# EasyEDA Pro project sonos_knobs_v1.1.eprj, board PCB5
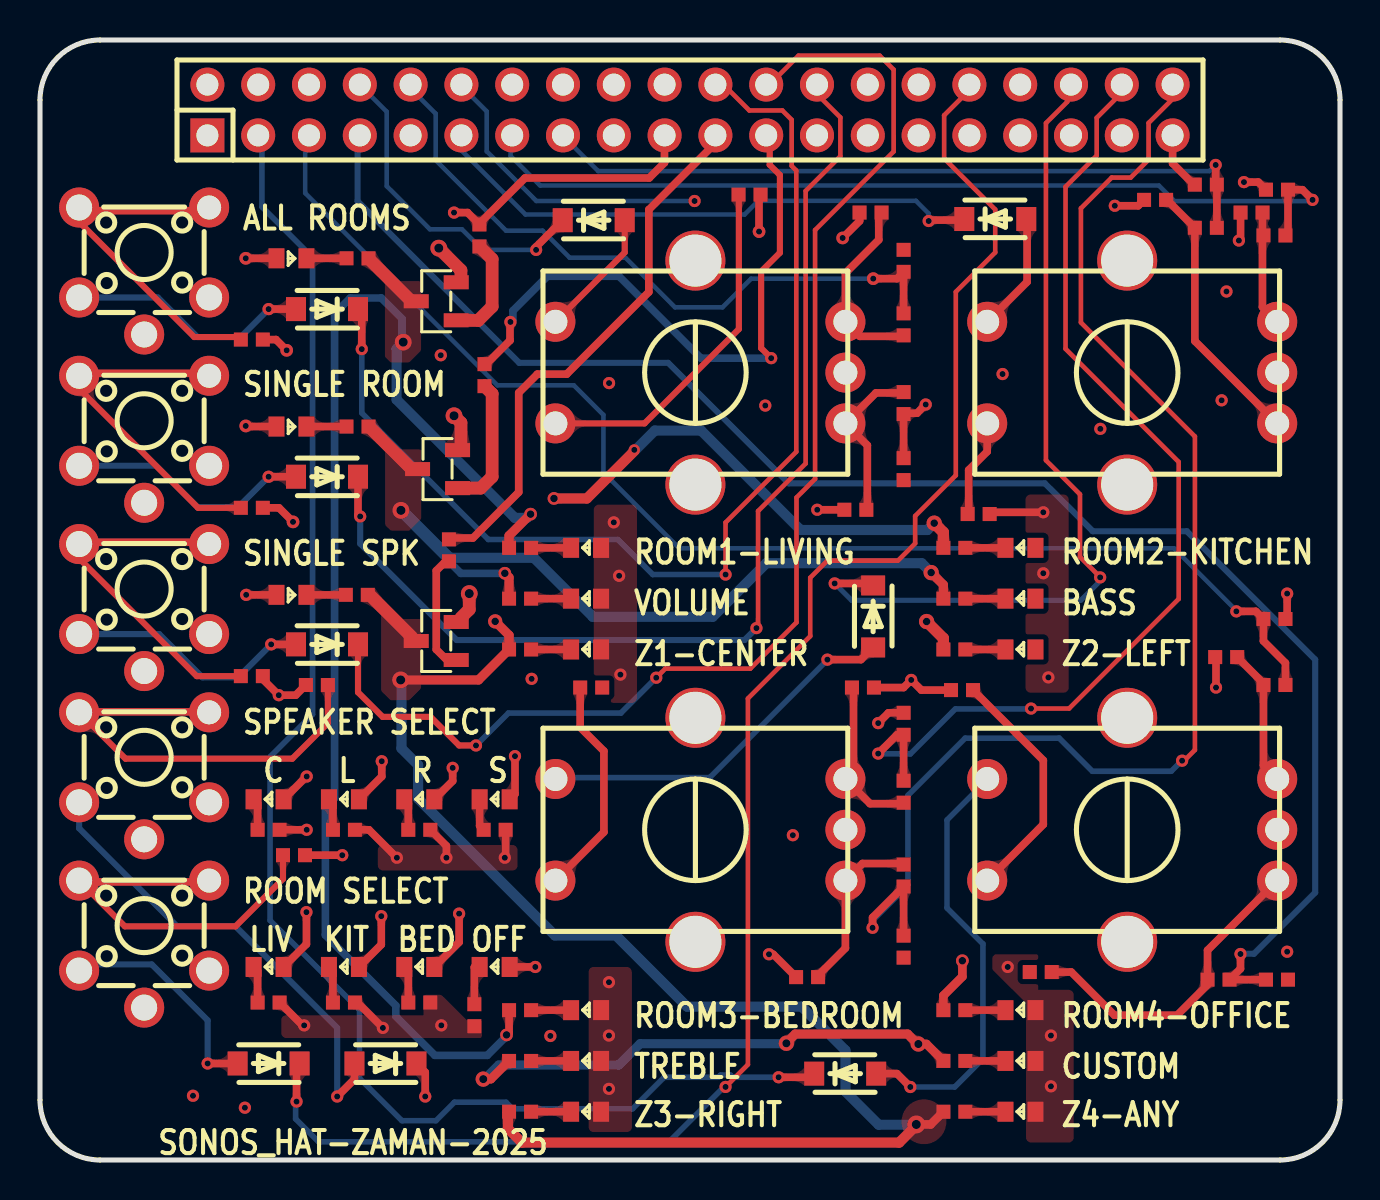
[diagram p4: board, top side]
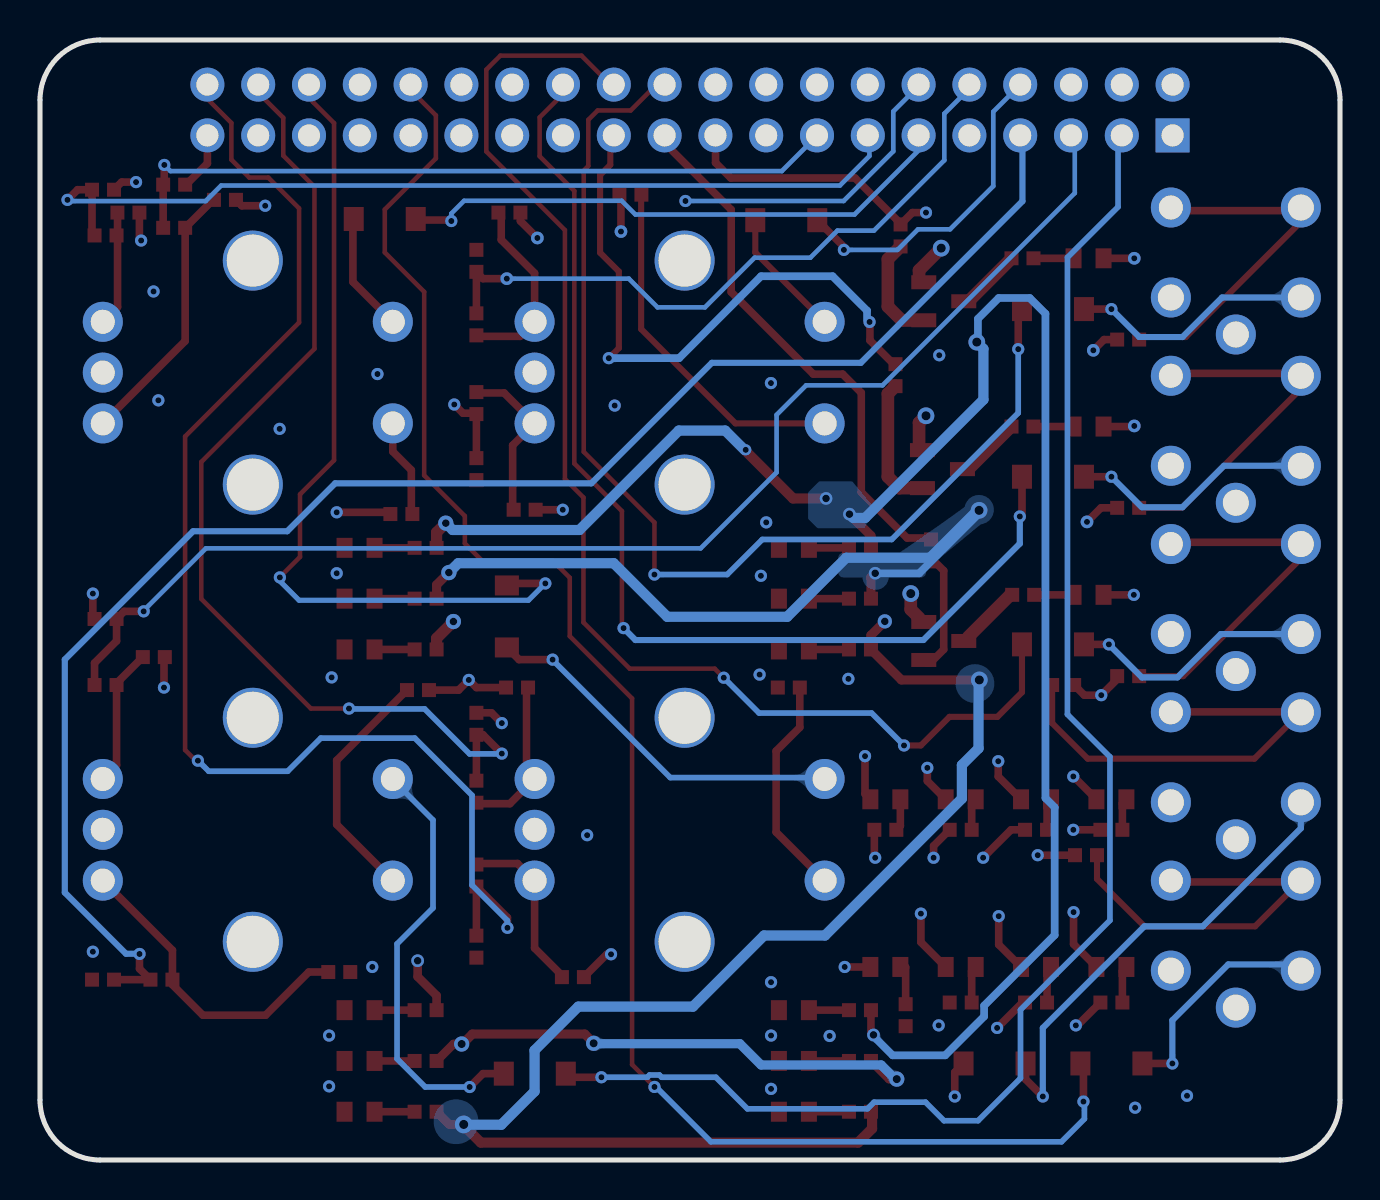
[diagram p5: board, bottom side, seen from below]

Outline 65 x 56 mm; copper layers: Top Layer, Inner1, Inner2, Bottom Layer. Coordinates in mm from the lower left corner of the outline.
Outline path: 0,53 0,3 arc(0.88,0.88) 3,0 62,0 arc(64.12,0.88) 65,3 65,53 arc(64.12,55.12) 62,56 3,56 arc(0.88,55.12) 0,53
Stack: Top Layer 0.035mm Outer layer thickness 1oz / Dielectric1 0.2104mm 7628 RC49% 8.6mil / Inner1 0.0152mm Inner layer thickness / Dielectric2 1.065mm 1.1mm H/HOZ Copper / Inner2 0.0152mm Inner layer thickness / Dielectric3 0.2104mm 7628 RC49% 8.6mil / Bottom Layer 0.035mm Outer layer thickness 1oz

## Design rules (mm)
template: Custom Config
spacing copperThickness1oz (default): track to track 0.102, other pairs 0.152 to 0.3
spacing copperThickness2oz: track to track 0.203, other pairs 0.152 to 0.3
track width copperThickness1oz (default): min 0.127, default 0.381, max 2.54
track width copperThickness2oz: min 0.203, default 0.254, max 2.54
differential pair differentialPair (default): width min 0.127, default 0.254, max 2.54; gap min 0.152, default 0.152
via viaSize (default): diameter min 0.5, default 0.61, max 10; hole min 0.3, default 0.305, max 6.3

## Placement (name value [footprint] x y rotation side)
C1  10nF  [C0402]  43.18 34.54 90 top
C2  10nF  [C0402]  43.18 44.96 270 top
C3  10nF  [C0402]  58.29 48.77 0 top
C4  10nF  [C0402]  61.85 48.51 0 top
C5  10nF  [C0402]  43.18 10.67 90 top
C6  10nF  [C0402]  43.18 21.81 270 top
C7  10nF  [C0402]  61.85 9.02 180 top
C8  10nF  [C0402]  61.72 27.05 180 top
D1  SM4007PL  [SOD-123F_L2.8-W1.8-LS3.7-RD]  14.35 42.55 180 top
D2  SM4007PL  [SOD-123F_L2.8-W1.8-LS3.7-RD]  14.35 34.16 180 top
D3  SM4007PL  [SOD-123F_L2.8-W1.8-LS3.7-RD]  14.35 25.78 180 top
D4  SM4007PL  [SOD-123F_L2.8-W1.8-LS3.7-RD]  17.27 4.83 180 top
D5  SM4007PL  [SOD-123F_L2.8-W1.8-LS3.7-RD]  11.43 4.83 180 top
D6  SM4007PL  [SOD-123F_L2.8-W1.8-LS3.7-RD]  27.69 46.99 0 top
D7  SM4007PL  [SOD-123F_L2.8-W1.8-LS3.7-RD]  47.76 47.05 0 top
D8  SM4007PL  [SOD-123F_L2.8-W1.8-LS3.7-RD]  41.66 27.18 270 top
D9  SM4007PL  [SOD-123F_L2.8-W1.8-LS3.7-RD]  40.26 4.32 0 top
H1  2.54-2*20P母长PC104  [HDR-TH_40P-P2.54-V-F-R2-C20-S2.54-2]  32.5 52.5 0 top
LED1  KT-0603R  [LED0603-RD]  12.57 45.08 180 top
LED2  KT-0603R  [LED0603-RD]  27.31 30.61 0 top
LED3  KT-0603R  [LED0603-RD]  49.02 30.61 0 top
LED4  KT-0603R  [LED0603-RD]  27.31 7.49 0 top
LED5  KT-0603R  [LED0603-RD]  49.02 7.49 0 top
LED6  KT-0603R  [LED0603-RD]  12.57 36.67 180 top
LED7  KT-0603R  [LED0603-RD]  27.31 28.07 0 top
LED8  KT-0603R  [LED0603-RD]  49.02 28.07 0 top
LED9  KT-0603R  [LED0603-RD]  27.31 4.95 0 top
LED10  KT-0603R  [LED0603-RD]  49.02 4.95 0 top
LED11  KT-0603R  [LED0603-RD]  12.57 28.26 180 top
LED12  KT-0603R  [LED0603-RD]  27.31 25.53 0 top
LED13  KT-0603R  [LED0603-RD]  49.02 25.53 0 top
LED14  KT-0603R  [LED0603-RD]  27.31 2.41 0 top
LED15  KT-0603R  [LED0603-RD]  49.02 2.41 0 top
LED16  KT-0603R  [LED0603-RD]  11.43 18.03 0 top
LED17  KT-0603R  [LED0603-RD]  15.2 18.03 0 top
LED18  KT-0603R  [LED0603-RD]  18.97 18.03 0 top
LED19  KT-0603R  [LED0603-RD]  22.73 18.03 0 top
LED20  KT-0603R  [LED0603-RD]  11.43 9.65 0 top
LED21  KT-0603R  [LED0603-RD]  15.2 9.65 0 top
LED22  KT-0603R  [LED0603-RD]  18.97 9.65 0 top
LED23  KT-0603R  [LED0603-RD]  22.73 9.65 0 top
Q1  MMBT2222A 1P  [SOT-23-3_L2.9-W1.3-P1.90-LS2.4-BR]  19.81 42.94 0 top
Q2  MMBT2222A 1P  [SOT-23-3_L2.9-W1.3-P1.90-LS2.4-BR]  19.88 34.54 0 top
Q3  MMBT2222A 1P  [SOT-23-3_L2.9-W1.3-P1.90-LS2.4-BR]  19.81 25.95 0 top
R1  10kΩ  [C0402]  43.18 37.85 90 top
R2  10kΩ  [C0402]  43.18 41.78 90 top
R3  10kΩ  [C0402]  40.77 32.51 0 top
R4  10kΩ  [C0402]  41.53 47.37 0 top
R5  10kΩ  [C0402]  58.29 46.61 180 top
R6  10kΩ  [C0402]  61.72 46.23 0 top
R7  10kΩ  [C0402]  55.75 48.01 180 top
R8  10kΩ  [C0402]  60.58 47.37 180 top
R9  10kΩ  [C0402]  43.18 14.22 270 top
R10  10kΩ  [C0402]  43.18 18.42 270 top
R11  10kΩ  [C0402]  38.35 9.14 0 top
R12  10kΩ  [C0402]  41.15 23.62 180 top
R13  10kΩ  [C0402]  58.93 9.02 180 top
R14  10kΩ  [C0402]  61.72 23.75 0 top
R15  10kΩ  [C0402]  50.04 9.4 180 top
R16  10kΩ  [C0402]  59.31 25.15 180 top
R18  1kΩ  [C0402]  21.97 46.23 270 top
R19  150Ω  [C0402]  15.88 45.08 180 top
R20  150Ω  [C0402]  24 30.61 0 top
R21  150Ω  [C0402]  45.72 30.61 0 top
R22  150Ω  [C0402]  24 7.49 0 top
R23  150Ω  [C0402]  45.72 7.49 0 top
R24  1kΩ  [C0402]  22.22 39.24 270 top
R25  150Ω  [C0402]  15.88 36.67 180 top
R26  150Ω  [C0402]  24 28.07 0 top
R27  150Ω  [C0402]  45.72 28.07 0 top
R28  150Ω  [C0402]  24 4.95 0 top
R29  150Ω  [C0402]  45.72 4.95 0 top
R30  1kΩ  [C0402]  20.45 30.48 270 top
R31  150Ω  [C0402]  15.84 28.26 180 top
R32  150Ω  [C0402]  24 25.53 0 top
R33  150Ω  [C0402]  45.72 25.53 0 top
R34  150Ω  [C0402]  24 2.41 0 top
R35  150Ω  [C0402]  45.72 2.41 0 top
R36  150Ω  [C0402]  11.43 16.51 180 top
R37  150Ω  [C0402]  15.2 16.51 180 top
R38  150Ω  [C0402]  18.97 16.51 180 top
R39  150Ω  [C0402]  22.73 16.51 180 top
R40  150Ω  [C0402]  11.43 7.87 180 top
R41  150Ω  [C0402]  15.2 7.87 180 top
R42  150Ω  [C0402]  18.97 7.87 180 top
R43  150Ω  [C0402]  21.72 7.24 90 top
R44  1kΩ  [C0402]  10.59 41.02 180 top
R45  1kΩ  [C0402]  10.59 32.61 180 top
R46  1kΩ  [C0402]  10.59 24.19 180 top
R48  1kΩ  [C0402]  13.84 23.75 0 top
R49  1kΩ  [C0402]  12.7 15.24 180 top
R50  1kΩ  [C0402]  35.48 48.27 0 top
R51  1kΩ  [C0402]  46.93 32.3 0 top
R52  1kΩ  [C0402]  27.56 23.62 0 top
R53  1kΩ  [C0402]  46.1 23.5 180 top
SW1  PEC12R-4230F-S0024  [SW-TH_PEC12R-4230F-S0024]  33.02 39.37 90 top
SW2  PEC12R-4230F-S0024  [SW-TH_PEC12R-4230F-S0024]  54.61 39.37 90 top
SW3  PEC12R-4230F-S0024  [SW-TH_PEC12R-4230F-S0024]  33.02 16.51 90 top
SW4  PEC12R-4230F-S0024  [SW-TH_PEC12R-4230F-S0024]  54.61 16.51 90 top
SW5  SKHHQVA010  [SW-TH_5P-L6.0-W6.0-P4.50-LS6.5]  5.21 44.45 0 top
SW6  SKHHQVA010  [SW-TH_5P-L6.0-W6.0-P4.50-LS6.5]  5.21 36.04 0 top
SW7  SKHHQVA010  [SW-TH_5P-L6.0-W6.0-P4.50-LS6.5]  5.21 27.62 0 top
SW8  SKHHQVA010  [SW-TH_5P-L6.0-W6.0-P4.50-LS6.5]  5.21 19.21 0 top
SW9  SKHHQVA010  [SW-TH_5P-L6.0-W6.0-P4.50-LS6.5]  5.21 10.8 0 top

## Footprints (pads in the part's own frame, mm; a bottom-side part is the same pattern mirrored in y, then rotated)
C0402
  rect 0.7x0.7 smd: 1(-0.55,0) 2(0.55,0)
HDR-TH_40P-P2.54-V-F-R2-C20-S2.54-2
  rect 1.7x1.7 hole 1.1: 1(-24.13,-1.27)
  round 1.7 hole 1.1: 2(-24.13,1.27) 3(-21.59,-1.27) 4(-21.59,1.27) 5(-19.05,-1.27) 6(-19.05,1.27) 7(-16.51,-1.27) 8(-16.51,1.27) 9(-13.97,-1.27) 10(-13.97,1.27) 11(-11.43,-1.27) 12(-11.43,1.27) 13(-8.89,-1.27) 14(-8.89,1.27) 15(-6.35,-1.27) 16(-6.35,1.27) 17(-3.81,-1.27) 18(-3.81,1.27) 19(-1.27,-1.27) 20(-1.27,1.27) 21(1.27,-1.27) 22(1.27,1.27) 23(3.81,-1.27) 24(3.81,1.27) 25(6.35,-1.27) 26(6.35,1.27) 27(8.89,-1.27) 28(8.89,1.27) 29(11.43,-1.27) 30(11.43,1.27) 31(13.97,-1.27) 32(13.97,1.27) 33(16.51,-1.27) 34(16.51,1.27) 35(19.05,-1.27) 36(19.05,1.27) 37(21.59,-1.27) 38(21.59,1.27) 39(24.13,-1.27) 40(24.13,1.27)
LED0603-RD
  rect 0.8x1 smd: 1(-0.75,0) 2(0.75,0)
SOD-123F_L2.8-W1.8-LS3.7-RD
  rect 1x1.2 smd: 1(-1.55,0) 2(1.55,0)
SOT-23-3_L2.9-W1.3-P1.90-LS2.4-BR
  rect 1.25x0.7 smd: 1(1,-0.95) 2(1,0.95) 3(-1,0)
SW-TH_5P-L6.0-W6.0-P4.50-LS6.5
  round 2 hole 1.3: 1(-3.25,3.175) 3(-3.25,-1.325) 4(3.25,-1.325) 5(0.002,-3.175)
  round 2 hole 1.199: 2(3.25,3.175)
SW-TH_PEC12R-4230F-S0024
  round 2 hole 1.2: 1(-2.54,7.25) 2(2.54,7.25) A(-2.54,-7.25) B(2.54,-7.25) C(0,-7.25)
  round 3 hole 2.6: 6(-5.601,0.25) 7(5.601,0.25)

## Nets
+3.3V: H1.1 H1.17 R3.1 R4.1 R7.2 R8.2 R11.1 R12.1 R15.2 R16.2 R44.1 R45.1 R46.1 R48.1 R49.1 R50.2 R51.2 R52.2 R53.2
+5V: H1.2 H1.4 LED1.2 LED2.2 LED3.2 LED4.2 LED5.2 LED6.2 LED7.2 LED8.2 LED9.2 LED10.2 LED11.2 LED12.2 LED13.2 LED14.2 LED15.2
GND: C1.1 C2.1 C3.1 C4.1 C5.1 C6.1 C7.1 C8.1 H1.6 H1.9 H1.14 H1.20 H1.25 H1.30 H1.34 H1.39 Q1.2 Q2.2 Q3.2 R36.1 R37.1 R38.1 R39.1 R40.1 R41.1 R42.1 R43.1 SW1.C SW2.C SW3.C SW4.C SW5.5 SW6.5 SW7.5 SW8.5 SW9.5
A_BASS: R9.1 R11.2 SW3.A
A_EXTRA: R13.2 R15.1 SW4.A
A_TREB: R5.2 R7.1 SW2.A
A_VOL: R1.2 R3.2 SW1.A
ALL_ROOM_LED: H1.19 R18.1
B_BASS: R10.2 R12.2 SW3.B
B_EXTRA: R14.1 R16.1 SW4.B
B_TREB: R6.1 R8.1 SW2.B
B_VOL: R2.1 R4.2 SW1.B
CLK_BASS: C5.2 H1.40 R9.2
CLK_EXTRA: C7.2 H1.7 R13.1
CLK_TREB: C3.2 H1.15 R5.1
CLK_VOL: C1.2 H1.12 R1.1
DT_BASS: C6.2 H1.38 R10.1
DT_EXTRA: C8.2 H1.5 R14.2
DT_TREB: C4.2 H1.13 R6.2
DT_VOL: C2.2 H1.10 R2.2
ROOM1_LED: H1.35 LED20.2
ROOM2_LED: H1.37 LED21.2
ROOM3_LED: H1.16 LED22.2
ROOM4_LED: H1.18 LED23.2
SINGLE_ROOM_LED: H1.21 R30.1
SINGLE_SPK_LED: H1.23 R24.1
SPK1_LED: H1.27 LED16.2
SPK2_LED: H1.29 LED17.2
SPK3_LED: H1.31 LED18.2
SPK4_LED: H1.33 LED19.2
SW_ALL_ROOM: D1.1 H1.22
SW_BASS: D8.1 H1.36
SW_CHG_ROOM: D5.1 H1.32
SW_CHG_SPK: D4.1 H1.28
SW_EXTRA: D9.1 H1.3
SW_SINGLE_ROOM: D3.1 H1.24
SW_SINGLE_SPK: D2.1 H1.26
SW_TREB: D7.1 H1.11
SW_VOL: D6.1 H1.8
$1N7890: R50.1 SW1.1
$1N7926: D6.2 SW1.2
$1N13826: D7.2 SW2.2
$1N13828: R51.1 SW2.1
$1N13924: D8.2 SW3.2
$1N13926: R52.1 SW3.1
$1N15952: D9.2 SW4.2
$1N15953: R53.1 SW4.1
$2N553: Q1.1 R18.2
$2N557: Q1.3 R19.1 R20.1 R21.1 R22.1 R23.1
$2N567: LED1.1 R19.2
$2N579: LED2.1 R20.2
$2N581: LED3.1 R21.2
$2N583: LED4.1 R22.2
$2N585: LED5.1 R23.2
$2N1083: Q2.1 R24.2
$2N1087: Q2.3 R25.1 R26.1 R27.1 R28.1 R29.1
$2N1097: LED6.1 R25.2
$2N1109: LED7.1 R26.2
$2N1111: LED8.1 R27.2
$2N1113: LED9.1 R28.2
$2N1115: LED10.1 R29.2
$2N1613: Q3.1 R30.2
$2N1617: Q3.3 R31.1 R32.1 R33.1 R34.1 R35.1
$2N1627: LED11.1 R31.2
$2N1639: LED12.1 R32.2
$2N1641: LED13.1 R33.2
$2N1643: LED14.1 R34.2
$2N1645: LED15.1 R35.2
$2N2275: LED16.1 R36.2
$2N2279: LED17.1 R37.2
$2N2284: LED18.1 R38.2
$2N2289: LED19.1 R39.2
$2N2294: LED20.1 R40.2
$2N2299: LED21.1 R41.2
$2N2307: LED22.1 R42.2
$2N2312: LED23.1 R43.2
$2N6344: R44.2 SW5.1 SW5.2
$2N6348: R45.2 SW6.1 SW6.2
$2N6353: R46.2 SW7.1 SW7.2
$2N6358: R49.2 SW9.1 SW9.2
$2N6363: R48.2 SW8.1 SW8.2
$2N6573: D1.2 SW5.3
$2N6576: D2.2 SW6.3
$2N6578: D3.2 SW7.3
$2N6580: D5.2 SW9.3
$2N6582: D4.2 SW8.3

Pads without a net: SW1 6 7; SW2 6 7; SW3 6 7; SW4 6 7; SW5 4; SW6 4; SW7 4; SW8 4; SW9 4

## Via types
v1: diameter 0.61, hole 0.305, Top Layer to Bottom Layer, 86 vias
v2: diameter 0.838, hole 0.457, Top Layer to Bottom Layer, 6 vias
v3: diameter 0.635, hole 0.305, Top Layer to Bottom Layer, 7 vias
v4: diameter 0.635, hole 0.381, Top Layer to Bottom Layer, 5 vias
v5: diameter 0.559, hole 0.305, Top Layer to Bottom Layer, 1 via
v6: diameter 0.762, hole 0.381, Top Layer to Bottom Layer, 3 vias
v7: diameter 0.762, hole 0.406, Top Layer to Bottom Layer, 3 vias
v8: diameter 0.711, hole 0.381, Top Layer to Bottom Layer, 1 via
v9: diameter 0.889, hole 0.457, Top Layer to Bottom Layer, 1 via

## Routing (per net, layer and track width the routed paths; a pad name or vN(x,y) marks a point on that pad's centre or on a via; arc(x,y) is an arc through that point)
+3.3V: length 26.2
  Top Layer w0.381: R12.1 43.18,23.62 v1(43.56,24) 44.07,23.5 R53.2 ; R11.1 36.66,10.29 v1(36.45,10.29) ; R3.1 v1(38.86,32.51) ; v3(12.65,31.91) 11.95,32.61 R45.1 ; 55.2,48.01 54.91,47.71 v1(53.74,47.71) ; 47.48,32.25 47.62,32.39 v1(50.16,32.39) ; R49.1 v1(15.11,15.24) ; R48.1 12.78,23.24 v1(11.94,23.24) 11.14,24.04 R46.1 ; R16.2 58.8,25.1 v1(58.8,23.62) ; v3(35.95,46.42) 35.95,48.3 35.98,48.32 ; 40.98,47.37 40.98,46.95 v3(40.13,46.1) ; R8.2 60.03,46.06 v1(59.94,45.97) ; R44.1 11.8,41.02 v3(12.33,40.48)
  vias: v1(50.16,29.34) v1(50.42,24.13)
+5V: length 4.6
  Top Layer w0.381: v3(10.29,36.7) 10.32,36.67 LED6.2 ; LED1.2 v3(10.29,45.08) ; LED11.2 v1(10.31,28.26)
  vias: v1(10.24,2.61) v1(24.58,24.06) v1(28.45,8.89) v1(28.45,6.22) v1(28.45,3.56) v1(28.69,31.88) v1(28.96,29.21) v1(29.02,24.27) v1(37.64,16.24) v1(48.39,9.65) v1(50.55,6.22) v1(50.55,3.68) v1(59.32,43.43)
GND: length 23.2
  Top Layer w0.381: 57.69,48.77 56.63,49.83 H1.39 ; v1(13.21,6.73) 13.12,6.73 R40.1 ; R37.1 16.45,16.51 v1(17.84,15.11) ; v1(17.15,6.6) 15.88,7.87 R41.1 ; 61.3,48.51 60.92,48.89 v1(60.2,48.89) ; R38.1 20.32,15.71 v1(20.32,15.11) ; R39.1 23.28,15.16 v1(23.24,15.11) ; R36.1 v1(13.34,16.51) ; v1(41.91,21.84) 42.43,22.36 C6.1 ; C8.1 62.36,27.14 v1(62.36,28.32)
  Top Layer w0.635: 21.05,35.49 21.05,36.86 v2(20.7,37.21) ; 21.05,43.88 21.05,44.48 v2(19.94,45.59) ; v2(21.46,28.32) 21.46,27.53 21.05,27.11
  vias: v1(7.65,3.21) v1(20.04,40.24) v1(20.07,6.73) v1(25.52,6.2) v1(28.45,38.85) v1(36.26,37.72) v1(48.13,39.3) v1(53.02,36.56) v1(59.08,37.98) v1(62.36,10.41)
A_BASS: length 8.7
  Top Layer w0.381: 43.18,14.82 41.12,14.82 SW3.A 40.27,10.59 38.9,9.23 R11.2
A_EXTRA: length 16
  Top Layer w0.381: R15.1 51.56,9.4 53.72,7.24 56.85,7.24 58.38,8.76 R13.2 58.38,10.49 SW4.A
A_TREB: length 13.5
  Top Layer w0.381: R7.1 56.35,48.01 R5.2 57.74,40.95 SW2.A
A_VOL: length 8.4
  Top Layer w0.381: 43.18,38.45 43.09,38.35 41.79,38.35 SW1.A 41.37,35.73 41.37,32.51
ALL_ROOM_LED: length 13.1
  Top Layer w0.381: R18.1 21.38,47.37 v1(20.7,47.37) ; 21.96,46.81 24.25,49.1 30.46,49.1 31.22,49.86 31.22,50.91
B_BASS: length 8.2
  Top Layer w0.381: 43.18,17.81 41.51,17.81 SW3.B 40.68,19.45 40.68,23.54 R12.2
B_EXTRA: length 6.9
  Top Layer w0.381: SW4.B 61.17,19.74 R14.1 61.17,23.83 R16.1
B_TREB: length 5.8
  Top Layer w0.381: SW2.B 61.12,42.65 61.12,47.31 61.18,47.37
B_VOL: length 9.4
  Top Layer w0.381: 43.18,41.18 41,41.18 SW1.B 40.27,44.34 41.94,46.01 41.94,47.18 42.13,47.37
CLK_BASS: length 67.3
  Top Layer w0.229: v1(57.1,19.97) 57.1,19.93 57.18,19.93 57.75,20.5 57.75,36.18 52.05,41.87 52.05,47.58 53.59,49.12 54.54,49.12 55.43,50.02 55.43,51.85 56.68,53.1 56.68,53.51 56.48,53.71 56.48,53.77
  Top Layer w0.381: R9.2 41.63,12.12 v1(41.63,11.61) ; 43.18,11.27 43.18,13.62
  Bottom Layer w0.28: v1(57.1,19.97) 57.09,19.97 56.56,19.44 52.62,19.44 50.96,21.09 46.26,21.09 43.4,18.23 43.4,13.74 41.63,11.97 v1(41.63,11.61)
CLK_EXTRA: length 81.2
  Top Layer w0.381: 61.3,9.02 R13.1 60.02,9.56 v1(60.02,10.3)
  Bottom Layer w0.305: v1(60.02,10.3) 60.09,10.3 60.1,10.31 60.7,10.31 63.76,13.37 63.76,25.02 57.34,31.44 52.64,31.44 50.24,33.83 37.43,33.83 31.41,39.86 23.96,39.86 15.88,47.94 15.88,51.74
CLK_TREB: length 36.7
  Top Layer w0.381: 58.88,48.77 58.79,48.86 58.79,49.7 ; C3.2 R5.1
  Bottom Layer w0.229: 26.08,51.27 27.91,49.44 58.48,49.44 v1(58.78,49.75)
CLK_VOL: length 46.1
  Top Layer w0.381: 44.21,37.7 43.85,37.34 43.19,37.34 ; 43.18,37.25 43.18,35.14
  Inner1 w0.229: 32.69,47.9 31.21,47.9 29.78,46.46 29.78,41.44 36.73,34.49 41.19,34.49 42.34,35.64 42.34,36.18 43.98,37.83 44.31,37.83
  Bottom Layer w0.229: 21.06,53.7 22.34,52.43 22.34,50.43 24.82,47.95 v1(32.73,47.95)
  vias: v1(44.29,37.77)
DT_BASS: length 51
  Top Layer w0.229: 54.09,53.56 54.09,53.37 52.84,52.11 52.84,50.22 51.28,48.66 51.28,40.56 56.94,34.9 56.94,28.06 51.45,22.57 v1(49.55,22.57)
  Top Layer w0.381: 43.18,19.02 43.18,21.21 ; v1(41.91,20.32) 42.85,21.26 C6.2
  Bottom Layer w0.28: 41.91,20.31 43.52,20.31 45.77,22.55 49.5,22.55 49.5,22.56
DT_EXTRA: length 65.3
  Top Layer w0.381: R14.2 62.27,24.85 61.17,25.95 C8.2 60.79,27.43 v1(59.82,27.43)
  Bottom Layer w0.229: 13.26,51.53 13.26,48.35 22.87,38.73 26.69,38.73 28.17,37.26 28.17,34.38 31.97,30.58 56.7,30.58 59.82,27.47
DT_TREB: length 45.8
  Top Layer w0.381: R6.2 62.4,46.36 C4.2 63.12,48.51 v1(63.63,48.01)
  Bottom Layer w0.229: 63.61,47.94 56.72,47.94 55.94,48.72 25.01,48.72 23.53,50.2 23.53,51.24
DT_VOL: length 33.4
  Top Layer w0.381: 43.18,44.39 42.85,44.07 v3(41.66,44.07) ; 43.18,44.36 43.18,42.38
  Bottom Layer w0.229: 18.44,53.66 19.78,52.32 19.78,49.99 23.3,46.47 25.13,46.47 26.48,45.11 29.27,45.11 31.75,42.63 34.12,42.63 35.56,44.07 v3(41.66,44.07)
ROOM1_LED: length 69.8
  Top Layer w0.381: v1(13.32,12.39) 13.32,10.79 LED20.2
  Inner2 w0.305: v1(13.32,12.39) 13.36,12.39 14.32,13.35 15.12,13.35 16.24,14.47 16.24,15.78 17.25,16.79 34.46,16.79 43.01,25.34 44.72,25.34 51.31,31.93 51.31,51.2 51.62,51.5
ROOM2_LED: length 92.3
  Top Layer w0.381: v1(17.06,12.19) 17.06,10.77 LED21.2
  Inner2 w0.28: 58.19,16.69 58.56,17.05 58.56,21.52 57.04,23.04 57.04,47.18 54.02,50.2 54.02,51.28 ; 58.19,16.69 57.88,16.39 57.88,8.47 56.71,7.31 31.77,7.31 27.03,12.04 23.48,12.04 22.27,13.25 18.31,13.25 17.17,12.1 ; 58.19,16.69 58.18,16.68 ; 54.02,51.28 53.88,51.28 ; 54.02,51.28 54.02,51.34
ROOM3_LED: length 80.9
  Top Layer w0.381: LED22.2 20.96,10.89 v1(20.96,12.32)
  Inner2 w0.254: 25.96,53.73 25.96,53 24.87,51.92 24.87,50.42 23.26,48.8 18.62,48.8 13.55,43.73 13.55,34.64 11.3,32.4 11.3,27.67 10.35,26.72 10.35,10.64 12.9,8.09 26.19,8.09 26.44,8.34 26.44,9.83 25.31,10.96 22.32,10.96 20.85,12.43
ROOM4_LED: length 66.5
  Top Layer w0.381: v1(24.76,9.65) LED23.2
  Inner2 w0.254: 24.74,9.54 14.43,9.54 11.93,12.05 11.93,20.68 13.3,22.05 13.3,28.81 14.84,30.35 14.84,42.24 16.39,43.79 20.91,43.79 27.43,50.31 27.43,52.56 28.53,53.66 28.53,53.86
SINGLE_ROOM_LED: length 27
  Top Layer w0.381: 20.4,31.1 21.65,31.1 23.94,33.39 23.94,38.36 24.87,39.29 26.33,39.29 30.44,43.4 30.44,47.52 33.85,50.93
SINGLE_SPK_LED: length 30.7
  Top Layer w0.305: 36.14,51.24 36.49,50.89 36.49,49.76 36.99,49.25 36.99,45.36 36.06,44.43 36.06,40.59 v1(36.56,40.09)
  Top Layer w0.381: 22.24,39.71 23.5,40.98 23.5,41.98
  Bottom Layer w0.381: v1(36.56,40.09) 33.04,40.09 28.95,44.19 25.37,44.19 23.65,42.47 23.65,42.02
  vias: v1(23.52,41.9)
SPK1_LED: length 46.6
  Top Layer w0.381: LED16.2 13.32,19.18 v1(13.34,19.18)
  Inner2 w0.28: 13.35,19.12 15.3,21.07 15.3,25.77 24.32,34.79 26.53,34.79 41.48,49.74 41.48,51.18
SPK2_LED: length 45
  Top Layer w0.381: LED17.2 17.09,19.17 v1(17.09,19.94)
  Inner2 w0.28: 43.85,51.13 43.85,48.31 24.08,28.53 24.08,26.35 17.78,20.05 17.03,20.05
SPK3_LED: length 48.4
  Top Layer w0.381: v1(20.63,19.61) 20.63,18.95 LED18.2
  Inner2 w0.28: 20.54,19.73 20.09,20.18 20.09,20.74 21.76,22.41 25.47,22.41 36.99,33.94 40.36,33.94 42.86,36.44 42.86,42.76 46.58,46.48 46.58,50.88
SPK4_LED: length 55.9
  Top Layer w0.381: v1(23.75,20.19) 23.75,18.3 LED19.2
  Inner2 w0.28: 23.81,20.29 24.49,20.96 27.61,20.96 29.17,19.4 34.54,19.4 37.28,22.14 37.28,28.29 39.09,30.1 41.59,30.1 42.27,30.77 42.27,31.49 44.8,34.03 48.57,34.03 49.68,35.13 49.7,50.48 49.05,51.14
SW_ALL_ROOM: length 55.7
  Top Layer w0.229: v1(34.28,29.27) 34.28,31.88 37.81,35.41 37.81,49.47 37.58,49.7 37.58,52.01 37.12,52.48 35.47,52.48 33.91,54.04 33.86,54.04
  Top Layer w0.381: D1.1 16.09,42.36 v1(16.09,40.54)
  Bottom Layer w0.28: v1(34.28,29.27) 30.64,29.27 28.89,31.03 22.41,31.03 16.09,37.35 v1(16.09,40.54)
SW_BASS: length 42.1
  Top Layer w0.229: 53,29.16 52,30.15 52,33.28 50.3,34.98 50.3,51.84 51.36,52.91 51.36,53.57 51.46,53.67
  Top Layer w0.381: 41.56,28.69 41.42,28.83 v1(39.73,28.83)
  Bottom Layer w0.254: v1(39.73,28.83) 40.58,27.98 52.04,27.98 53.09,29.03
  vias: v1(53.01,29.13)
SW_CHG_ROOM: length 85.3
  Top Layer w0.229: v1(34.28,3.65) 35.4,4.77 35.4,23.08 38.51,26.19 38.51,29.11 39.36,29.97 42.9,29.97 43.76,30.83 43.76,32.2 45.79,34.23 45.79,43.41 47.76,45.38 47.76,47.52 45.21,50.08 45.21,52.23 46.3,53.32 46.3,53.75 46.37,53.82
  Top Layer w0.381: v1(12.83,2.92) 12.83,4.67 D5.1
  Bottom Layer w0.28: 34.23,3.68 31.46,0.91 13.92,0.91 12.78,2.06 12.78,2.99
SW_CHG_SPK: length 66.6
  Top Layer w0.381: D4.1 19.26,4.39 v1(19.26,3.17)
  Inner1 w0.229: 41.25,53.83 41.25,53.51 42.56,52.2 42.56,49.96 42.33,49.73 42.33,46.18 45.42,43.09 45.42,36.56 42.44,33.58 42.44,25.57 24.65,7.78 22.53,7.78 19.29,4.55 19.29,3.47 19.09,3.27 ; 19.13,3.16 19.13,3.27
SW_EXTRA: length 75.5
  Top Layer w0.381: v1(36.93,4.14) 38.53,4.14 D9.1
  Bottom Layer w0.28: v1(36.93,4.14) 34.64,4.14 34.52,4.25 34.03,4.25 33.92,4.14 31.21,4.14 29.63,2.56 23.63,2.56 23.3,2.89 20.72,2.89 19.8,1.97 18.1,1.97 15.98,4.09 15.98,7.51 11.5,11.98 11.5,20.16 13.63,22.28 13.63,45.13 11.1,47.66 11.1,50.85
SW_SINGLE_ROOM: length 64.6
  Top Layer w0.229: 36.46,54.07 36.78,54.07 37.93,55.22 41.98,55.22 42.68,54.52 42.68,50.43 38.75,46.5 38.75,34.05 37.83,33.12 37.83,26.88 35.51,24.57 31.26,24.57 v1(30.81,24.11)
  Top Layer w0.305: D3.1 15.9,23.38 17.13,22.16 19.53,22.16 20.96,20.73 v1(21.8,20.73)
  Bottom Layer w0.28: v1(30.81,24.11) 29.04,22.35 23.42,22.35 v1(21.8,20.73)
SW_SINGLE_SPK: length 55
  Top Layer w0.229: v1(35.82,26.59) 35.9,26.68 35.9,32.44 38.28,34.83 38.28,48.45 40.02,50.19 40.02,52.13 38.74,53.41 38.74,53.74 38.85,53.85
  Top Layer w0.381: v1(16.01,32.18) 15.9,32.29 D2.1
  Bottom Layer w0.305: v1(16.01,32.18) 16.01,30.82 20.83,26 35.23,26 v1(35.82,26.59)
SW_TREB: length 28.1
  Top Layer w0.381: 46.31,47.06 46.25,47 44.56,47
  Bottom Layer w0.229: 20.93,51.17 20.93,50.62 24.28,47.27 35.23,47.27 35.92,47.96 43.8,47.96 44.43,47.32 v1(44.43,46.95)
SW_VOL: length 16.2
  Top Layer w0.381: D6.1 24.81,45.66 v1(24.81,45.51)
  Bottom Layer w0.229: 16.15,53.6 17.34,52.41 17.34,48.69 19.5,46.53 21.1,46.53 22.13,45.51 v1(24.81,45.51)
$1N7890: length 17.8
  Top Layer w0.305: SW1.1 30.23,36.83 34.94,41.55 34.94,48.13 34.85,48.22
$1N7926: length 6.5
  Top Layer w0.305: D6.2 29.24,45.38 SW1.2
$1N13826: length 5.9
  Top Layer w0.381: 49.32,47.02 49.35,46.98 49.35,43.9 SW2.2
$1N13828: length 4.9
  Top Layer w0.381: 46.4,32.34 46.43,32.38 46.43,34.5 47.36,35.42 SW2.1
$1N13924: length 18.5
  Top Layer w0.381: v1(39.37,25.02) 41.05,25.02 D8.2
  Bottom Layer w0.28: 39.5,25.13 33.49,19.12 26.03,19.12
$1N13926: length 11.1
  Top Layer w0.381: SW3.1 28.19,16.39 28.19,20.45 27.01,21.63 R52.1
$1N15952: length 21.7
  Top Layer w0.381: v1(43.52,3.65) 42.85,4.32 D9.2
  Bottom Layer w0.28: 47.36,19.01 45.35,17 45.35,12.6 47.15,10.8 47.15,5.06 45.74,3.65 v1(43.52,3.65)
$1N15953: length 12.1
  Top Layer w0.381: R53.1 50.16,19.98 50.16,16.78 SW4.1
$2N553: length 5.1
  Top Layer w0.635: R18.2 22.61,45.04 22.61,42.67 21.91,41.98 21.05,41.98
$2N557: length 122.1
  Top Layer w0.381: v4(23.33,6.25) 23.45,6.38 R22.1
  Top Layer w0.432: R23.1 45.17,8.22 46.12,9.17 v4(46.12,9.96)
  Top Layer w0.457: R20.1 23.45,31.22 v4(24.53,32.29)
  Top Layer w0.508: v4(25.7,33.08) 27.34,33.08 29.71,35.45
  Top Layer w0.559: v6(44.71,31.84) 45.17,31.38 R21.1
  Top Layer w0.635: R19.1 16.43,45.08 18.58,42.93
  Inner1 w0.381: v4(46.12,9.96) 46.55,9.96 51.8,15.21 51.8,25.45 45.44,31.82 44.74,31.82 v6(44.71,31.84)
  Bottom Layer w0.381: 18.1,40.84 18.1,42.06 17.06,43.1 15.51,43.1 14.73,42.32 14.73,18.1 14.27,17.64 14.27,11.24 17.79,7.72 17.79,7.18 19.74,5.23 22.37,5.23 23.39,6.26
  Bottom Layer w0.508: v6(44.71,31.84) 44.37,31.5 38.03,31.5 33.06,36.47 30.74,36.47 29.78,35.51 ; 18.01,40.74 17.83,40.56 17.83,38.02 23.74,32.11 24.34,32.11 v4(24.53,32.29)
  vias: v2(18.16,40.89) v5(29.71,35.51)
$2N567: length 2
  Top Layer w0.381: R19.2 LED1.1
$2N579: length 2
  Top Layer w0.381: LED2.1 24.6,30.61
$2N581: length 2
  Top Layer w0.381: LED3.1 46.32,30.61
$2N583: length 2
  Top Layer w0.381: LED4.1 24.6,7.49
$2N585: length 2
  Top Layer w0.381: LED5.1 46.32,7.49
$2N1083: length 6.5
  Top Layer w0.635: 21.05,33.59 22.04,33.59 22.61,34.16 22.61,38.31 R24.2
$2N1087: length 97.8
  Top Layer w0.432: R29.1 44.32,5.8 v7(43.92,5.8) ; v7(22.16,4.04) 22.54,4.04 R28.1
  Top Layer w0.457: 43.88,5.8 43.38,6.3 37.76,6.3 37.32,5.86 ; v6(44.56,29.37) 45.17,28.76 R27.1 ; R26.1 23.45,29.12 v4(23.24,29.34)
  Top Layer w0.635: 18.58,34.54 16.45,36.67 R25.1
  Inner1 w0.381: v7(43.92,5.8) 44.55,6.43 44.55,14.89 46.18,16.51 48.24,16.51 49.91,18.18 49.91,19.77 47.8,21.88 47.8,26.13 v6(44.56,29.37)
  Bottom Layer w0.381: 18.03,32.46 18.03,32.46 ; 18.03,32.34 21.04,29.33 23.27,29.33
  Bottom Layer w0.457: 22.28,4.09 22.94,4.75 28.94,4.75 30.01,5.81 37.32,5.81
  Bottom Layer w0.508: 18.15,32.46 20.5,30.11 24.69,30.11 27.64,27.16 33.63,27.16 36.32,29.84 44.09,29.84 v6(44.56,29.37)
  vias: v2(18.05,32.48) v7(37.32,5.83)
$2N1097: length 2
  Top Layer w0.381: R25.2 LED6.1
$2N1109: length 2
  Top Layer w0.381: 24.6,28.07 LED7.1
$2N1111: length 2
  Top Layer w0.381: LED8.1 46.32,28.07
$2N1113: length 2
  Top Layer w0.381: LED9.1 24.6,4.95
$2N1115: length 2
  Top Layer w0.381: LED10.1 46.32,4.95
$2N1613: length 6.3
  Top Layer w0.381: R30.2 20.28,29.93 19.81,29.47 19.81,25.53 20.46,24.88 20.71,24.88 20.75,24.92 21.05,24.92
$2N1617: length 105.2
  Top Layer w0.432: v9(43.81,1.78) 44.53,1.78 R35.1
  Top Layer w0.457: v8(22.76,26.93) 23.45,26.24 R32.1 21.93,24 v2(18.03,24)
  Top Layer w0.508: 23.41,2.38 23.4,2.37 23.4,1.57 24.09,0.87 42.96,0.87 43.85,1.76
  Top Layer w0.559: R33.1 45.17,26.08 v6(44.33,26.92)
  Top Layer w0.635: 18.58,26.16 16.48,28.26 R31.1
  Inner1 w0.457: 43.7,1.73 41.87,1.73 40.92,2.68 40.92,7.74 43.13,9.95 43.13,19.5 45.6,21.97 45.6,25.66 v6(44.33,26.92)
  Bottom Layer w0.381: 18.07,24.02 18,24.09
  Bottom Layer w0.457: 43.81,1.83 43.81,1.82
  Bottom Layer w0.508: 43.76,1.76 41.94,1.76 40.27,3.43 40.27,5.48 38.09,7.67 32.35,7.67 28.8,11.23 25.75,11.23 18.91,18.07 18.91,19.75 18.07,20.58 18.07,24.02
$2N1627: length 2
  Top Layer w0.381: LED11.1 R31.2
$2N1639: length 2
  Top Layer w0.381: LED12.1 24.6,25.53
$2N1641: length 2
  Top Layer w0.381: LED13.1 46.32,25.53
$2N1643: length 2
  Top Layer w0.381: LED14.1 24.6,2.41
$2N1645: length 2
  Top Layer w0.381: LED15.1 46.32,2.41
$2N2275: length 1.6
  Top Layer w0.381: LED16.1 10.88,17.83 R36.2
$2N2279: length 1.6
  Top Layer w0.381: LED17.1 14.65,17.83 R37.2
$2N2284: length 1.6
  Top Layer w0.381: R38.2 18.42,17.83 LED18.1
$2N2289: length 1.6
  Top Layer w0.381: R39.2 21.98,16.71 LED19.1
$2N2294: length 1.9
  Top Layer w0.381: LED20.1 10.88,9.45 R40.2
$2N2299: length 1.9
  Top Layer w0.381: LED21.1 14.65,9.45 R41.2
$2N2307: length 1.9
  Top Layer w0.381: LED22.1 18.42,9.45 R42.2
$2N2312: length 1.9
  Top Layer w0.381: 21.73,9.65 21.72,9.64 R43.2
$2N6344: length 17.7
  Top Layer w0.305: 1.96,47.47 1.96,46.9 7.71,41.15 9.91,41.15 R44.2
  Top Layer w0.381: 1.92,47.47 8.51,47.47
$2N6348: length 17.8
  Top Layer w0.305: SW6.1 1.96,38.56 7.9,32.61 R45.2
  Top Layer w0.381: 1.96,39.33 8.42,39.33 8.51,39.24
$2N6353: length 17.7
  Top Layer w0.305: R46.2 7.84,24.19 1.96,30.07 SW7.1
  Top Layer w0.381: 8.29,30.93 8.24,30.89 1.83,30.89
$2N6358: length 19.7
  Top Layer w0.305: R49.2 12.15,14.06 9.78,11.68 4.24,11.68 2.02,13.9
  Top Layer w0.381: 8.41,13.99 8.32,13.9 1.96,13.9
$2N6363: length 22.5
  Top Layer w0.305: SW8.1 4.28,20.07 12.62,20.07 14.39,21.84 R48.2
  Top Layer w0.381: 1.97,22.41 8.48,22.41
$2N6573: length 12.2
  Top Layer w0.381: D1.2 v1(11.43,42.55)
  Bottom Layer w0.305: SW5.3 5.9,43.12 7.87,41.15 10.03,41.15 v1(11.43,42.55)
$2N6576: length 12.3
  Top Layer w0.381: v1(11.43,34.16) D2.2
  Bottom Layer w0.305: SW6.3 5.8,34.71 7.87,32.64 9.91,32.64 v1(11.43,34.16)
$2N6578: length 12.4
  Top Layer w0.381: D3.2 v1(11.56,25.78)
  Bottom Layer w0.305: v1(11.56,25.78) 9.91,24.13 8.13,24.13 5.96,26.3 SW7.3
$2N6580: length 11.4
  Top Layer w0.381: D5.2 v1(8.38,4.83)
  Bottom Layer w0.305: v1(8.38,4.83) 8.38,6.98 5.59,9.78 2.27,9.78 SW9.3
$2N6582: length 23.8
  Top Layer w0.381: D4.2 15.72,4.04 v1(14.86,3.17)
  Bottom Layer w0.305: SW8.3 1.96,16.58 6.86,11.68 9.78,11.68 14.86,6.6 v1(14.86,3.17)

## Copper pours and planes (outline as drawn; the poured copper is in the pictures)
+3.3V on Top Layer: 49.28,33.02 49.3,33.12 49.35,33.2 49.43,33.25 49.53,33.27 51.18,33.27 51.28,33.25 51.36,33.2 51.42,33.12 51.44,33.02 51.44,23.62 51.42,23.52 51.36,23.44 51.28,23.39 51.18,23.37 49.53,23.37 49.43,23.39 49.35,23.44 49.3,23.52 49.28,23.62
+3.3V on Inner2: 15.24,53 15.25,53.26 15.3,53.61 15.39,53.94 15.52,54.27 15.69,54.57 15.89,54.86 16.12,55.12 16.38,55.35 16.67,55.55 16.97,55.72 17.3,55.85 17.63,55.94 17.98,55.99 18.24,56 77.24,56 77.5,55.99 77.85,55.94 78.18,55.85 78.51,55.72 78.82,55.55 79.1,55.35 79.36,55.12 79.59,54.86 79.79,54.57 79.96,54.27 80.09,53.94 80.18,53.61 80.23,53.26 80.24,53 80.24,3 80.23,2.74 80.18,2.39 80.09,2.05 79.96,1.73 79.79,1.42 79.59,1.14 79.36,0.88 79.1,0.65 78.82,0.45 78.51,0.28 78.18,0.15 77.85,0.06 77.5,0.01 77.24,0 18.24,0 17.98,0.01 17.63,0.06 17.3,0.15 16.97,0.28 16.67,0.45 16.38,0.65 16.12,0.88 15.89,1.14 15.69,1.42 15.52,1.73 15.39,2.05 15.3,2.39 15.25,2.74 15.24,3
+5V on Top Layer: 49.31,8.25 49.32,8.35 49.38,8.43 49.46,8.49 49.56,8.51 51.44,8.51 51.53,8.49 51.61,8.43 51.67,8.35 51.69,8.25 51.69,1.13 51.67,1.03 51.61,0.95 51.53,0.89 51.44,0.88 49.56,0.88 49.46,0.89 49.38,0.95 49.32,1.03 49.31,1.13
+5V on Top Layer: 27.43,9.4 27.45,9.5 27.51,9.58 27.59,9.63 27.69,9.65 29.34,9.65 29.43,9.63 29.52,9.58 29.57,9.5 29.59,9.4 29.59,1.65 29.57,1.55 29.52,1.47 29.43,1.42 29.34,1.4 27.69,1.4 27.59,1.42 27.51,1.47 27.45,1.55 27.43,1.65
+5V on Top Layer: 49.91,10.29 49.91,7.75 49.4,7.75 47.62,9.53 47.62,10.15 47.75,10.29
+5V on Top Layer: 27.69,32.51 27.71,32.61 27.76,32.69 27.84,32.75 27.94,32.77 29.59,32.77 29.69,32.75 29.77,32.69 29.83,32.61 29.84,32.51 29.84,23.11 29.83,23.02 29.77,22.93 29.69,22.88 29.59,22.86 27.94,22.86 27.84,22.88 27.76,22.93 27.71,23.02 27.69,23.11
+5V on Inner2: -51.42,53 -51.4,53.26 -51.35,53.61 -51.26,53.94 -51.13,54.27 -50.97,54.57 -50.77,54.86 -50.54,55.12 -50.28,55.35 -49.99,55.55 -49.68,55.72 -49.36,55.85 -49.02,55.94 -48.68,55.99 -48.42,56 10.59,56 10.85,55.99 11.19,55.94 11.53,55.85 11.85,55.72 12.16,55.55 12.45,55.35 12.71,55.12 12.94,54.86 13.14,54.57 13.3,54.27 13.43,53.94 13.52,53.61 13.57,53.26 13.59,53 13.59,3 13.57,2.74 13.52,2.39 13.43,2.05 13.3,1.73 13.14,1.42 12.94,1.14 12.71,0.88 12.45,0.65 12.16,0.45 11.85,0.28 11.53,0.15 11.19,0.06 10.85,0.01 10.59,0 -48.42,0 -48.68,0.01 -49.02,0.06 -49.36,0.15 -49.68,0.28 -49.99,0.45 -50.28,0.65 -50.54,0.88 -50.77,1.14 -50.97,1.42 -51.13,1.73 -51.26,2.05 -51.35,2.39 -51.4,2.74 -51.42,3
GND on Top Layer: 16.89,15.49 16.91,15.59 16.97,15.67 17.05,15.73 17.15,15.75 23.62,15.75 23.72,15.73 23.8,15.67 23.86,15.59 23.88,15.49 23.88,14.73 23.86,14.63 23.8,14.55 23.72,14.5 23.62,14.48 17.15,14.48 17.05,14.5 16.97,14.55 16.91,14.63 16.89,14.73
GND on Top Layer: 12.06,6.98 12.08,7.08 12.14,7.16 12.22,7.22 12.32,7.24 19.94,7.24 20.04,7.22 20.12,7.16 20.17,7.08 20.19,6.98 20.19,6.35 20.17,6.25 20.12,6.17 20.04,6.12 19.94,6.1 12.32,6.1 12.22,6.12 12.14,6.17 12.08,6.25 12.06,6.35
GND on Top Layer: 19.18,6.6 19.69,6.1 22.1,6.1 22.1,6.99 21.33,6.99 20.07,8.25 19.18,8.25
GND on Inner1: 0,53 0.01,53.26 0.06,53.61 0.15,53.94 0.28,54.27 0.45,54.57 0.65,54.86 0.88,55.12 1.14,55.35 1.43,55.55 1.73,55.72 2.06,55.85 2.39,55.94 2.74,55.99 3,56 62,56 62.26,55.99 62.61,55.94 62.94,55.85 63.27,55.72 63.57,55.55 63.86,55.35 64.12,55.12 64.35,54.86 64.55,54.57 64.72,54.27 64.85,53.94 64.94,53.61 64.99,53.26 65,53 65,3 64.99,2.74 64.94,2.39 64.85,2.06 64.72,1.73 64.55,1.43 64.35,1.14 64.12,0.88 63.86,0.65 63.57,0.45 63.27,0.28 62.94,0.15 62.61,0.06 62.26,0.01 62,0 3,0 2.74,0.01 2.39,0.06 2.06,0.15 1.73,0.28 1.43,0.45 1.14,0.65 0.88,0.88 0.65,1.14 0.45,1.43 0.28,1.73 0.15,2.06 0.06,2.39 0.01,2.74 0,3
$2N557 on Top Layer: 19.05,40.47 19.05,43.94 17.56,43.94 17.25,44.26 17.25,40.16 17.53,39.88 18.46,39.88
$2N557 on Bottom Layer: 26.6,33.38 26.6,32.06 26.12,31.58 23.81,31.58 23.71,31.68 23.38,32.72 24.38,33.93 26.04,33.93
$2N1087 on Top Layer: 19.06,32.06 19.06,35.53 17.57,35.53 17.26,35.84 17.26,31.75 17.54,31.47 18.47,31.47
$2N1087 on Bottom Layer: 18.78,32.59 18.75,32.73 18.7,32.86 18.62,32.98 18.51,33.09 18.39,33.17 18.26,33.22 18.12,33.25 17.97,33.25 17.83,33.22 17.7,33.17 17.58,33.09 17.48,32.98 17.4,32.86 17.34,32.73 17.31,32.59 17.31,32.44 17.34,32.3 17.4,32.17 17.48,32.05 17.58,31.95 17.7,31.87 17.83,31.81 17.97,31.78 18.12,31.78 18.26,31.81 18.39,31.87 18.51,31.95 18.62,32.05 18.7,32.17 18.75,32.3 18.78,32.44
$2N1087 on Bottom Layer: 23.87,29.23 23.85,29.36 23.8,29.48 23.73,29.58 23.64,29.67 23.53,29.75 23.41,29.79 23.28,29.82 23.16,29.82 23.03,29.79 22.91,29.75 22.8,29.67 22.71,29.58 22.64,29.48 22.59,29.36 22.56,29.23 22.56,29.1 22.59,28.97 22.64,28.85 22.71,28.75 22.8,28.66 22.91,28.58 23.03,28.54 23.16,28.51 23.28,28.51 23.41,28.54 23.53,28.58 23.64,28.66 23.73,28.75 23.8,28.85 23.85,28.97 23.87,29.1
$2N1087 on Bottom Layer: 20.69,30.11 20.71,30.2 20.77,30.29 20.85,30.34 20.95,30.36 24.83,30.36 24.93,30.34 25.01,30.29 25.07,30.2 25.09,30.11 25.09,29.38 25.07,29.29 25.01,29.2 24.93,29.15 24.83,29.13 20.95,29.13 20.85,29.15 20.77,29.2 20.71,29.29 20.69,29.38
$2N1617 on Top Layer: 45.31,2 45.28,2.18 45.23,2.34 45.15,2.5 45.05,2.64 44.92,2.77 44.78,2.87 44.62,2.95 44.46,3 44.28,3.03 44.11,3.03 43.93,3 43.77,2.95 43.61,2.87 43.47,2.77 43.34,2.64 43.24,2.5 43.16,2.34 43.11,2.18 43.08,2 43.08,1.83 43.11,1.65 43.16,1.49 43.24,1.33 43.34,1.19 43.47,1.06 43.61,0.96 43.77,0.88 43.93,0.83 44.11,0.8 44.28,0.8 44.46,0.83 44.62,0.88 44.78,0.96 44.92,1.06 45.05,1.19 45.15,1.33 45.23,1.49 45.28,1.65 45.31,1.83
$2N1617 on Top Layer: 19.05,23.58 19.05,27.05 17.56,27.05 17.06,27.55 17.06,23.45 17.53,22.99 18.46,22.99
$2N1617 on Bottom Layer: 45.31,2 45.28,2.18 45.23,2.34 45.15,2.5 45.05,2.64 44.92,2.77 44.78,2.87 44.62,2.95 44.46,3 44.28,3.03 44.11,3.03 43.93,3 43.77,2.95 43.61,2.87 43.47,2.77 43.34,2.64 43.24,2.5 43.16,2.34 43.11,2.18 43.08,2 43.08,1.83 43.11,1.65 43.16,1.49 43.24,1.33 43.34,1.19 43.47,1.06 43.61,0.96 43.77,0.88 43.93,0.83 44.11,0.8 44.28,0.8 44.46,0.83 44.62,0.88 44.78,0.96 44.92,1.06 45.05,1.19 45.15,1.33 45.23,1.49 45.28,1.65 45.31,1.83
$2N1617 on Bottom Layer: 19.22,23.92 19.18,24.1 19.11,24.28 19,24.44 18.87,24.57 18.71,24.68 18.54,24.75 18.35,24.79 18.16,24.79 17.97,24.75 17.8,24.68 17.64,24.57 17.5,24.44 17.4,24.28 17.33,24.1 17.29,23.92 17.29,23.72 17.33,23.54 17.4,23.36 17.5,23.2 17.64,23.07 17.8,22.96 17.97,22.89 18.16,22.85 18.35,22.85 18.54,22.89 18.71,22.96 18.87,23.07 19,23.2 19.11,23.36 19.18,23.54 19.22,23.72

Small or netless copper shapes (teardrops, artwork), in the pictures only: 246 on Top Layer, 49 on Bottom Layer, 8 on Inner1, 8 on Inner2

## Text on the board
Top Silkscreen Layer: SONOS_HAT-ZAMAN-2025 | ALL ROOMS | SINGLE ROOM | SINGLE SPK | SPEAKER SELECT | ROOM SELECT | LIV | C | KIT | L | BED | R | OFF | S | ROOM1-LIVING | VOLUME | Z1-CENTER | ROOM3-BEDROOM | TREBLE | Z3-RIGHT | ROOM2-KITCHEN | BASS | Z2-LEFT | ROOM4-OFFICE | CUSTOM | Z4-ANY
